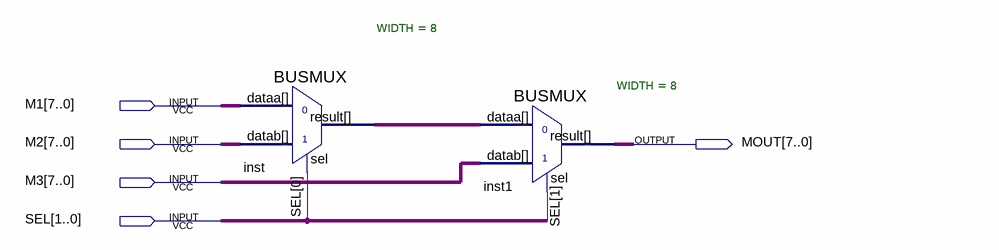
[diagram p0: schematic sheet]
// Quartus schematic Mux3_1.bdf as structural Verilog: 2 symbols, 5 pins
module Mux3_1 (
  input  [7:0] M1,
  input  [7:0] M2,
  input  [7:0] M3,
  input  [1:0] SEL,
  output [7:0] MOUT
);

  wire [7:0] inst_result;

  BUSMUX #(.WIDTH(8)) inst (.datab(M2), .sel(SEL[0]), .dataa(M1), .result(inst_result));
  BUSMUX #(.WIDTH(8)) inst1 (.datab(M3), .sel(SEL[1]), .dataa(inst_result), .result(MOUT));
endmodule
